# EAGLE design ambe_v2 (EAGLE 6.3)
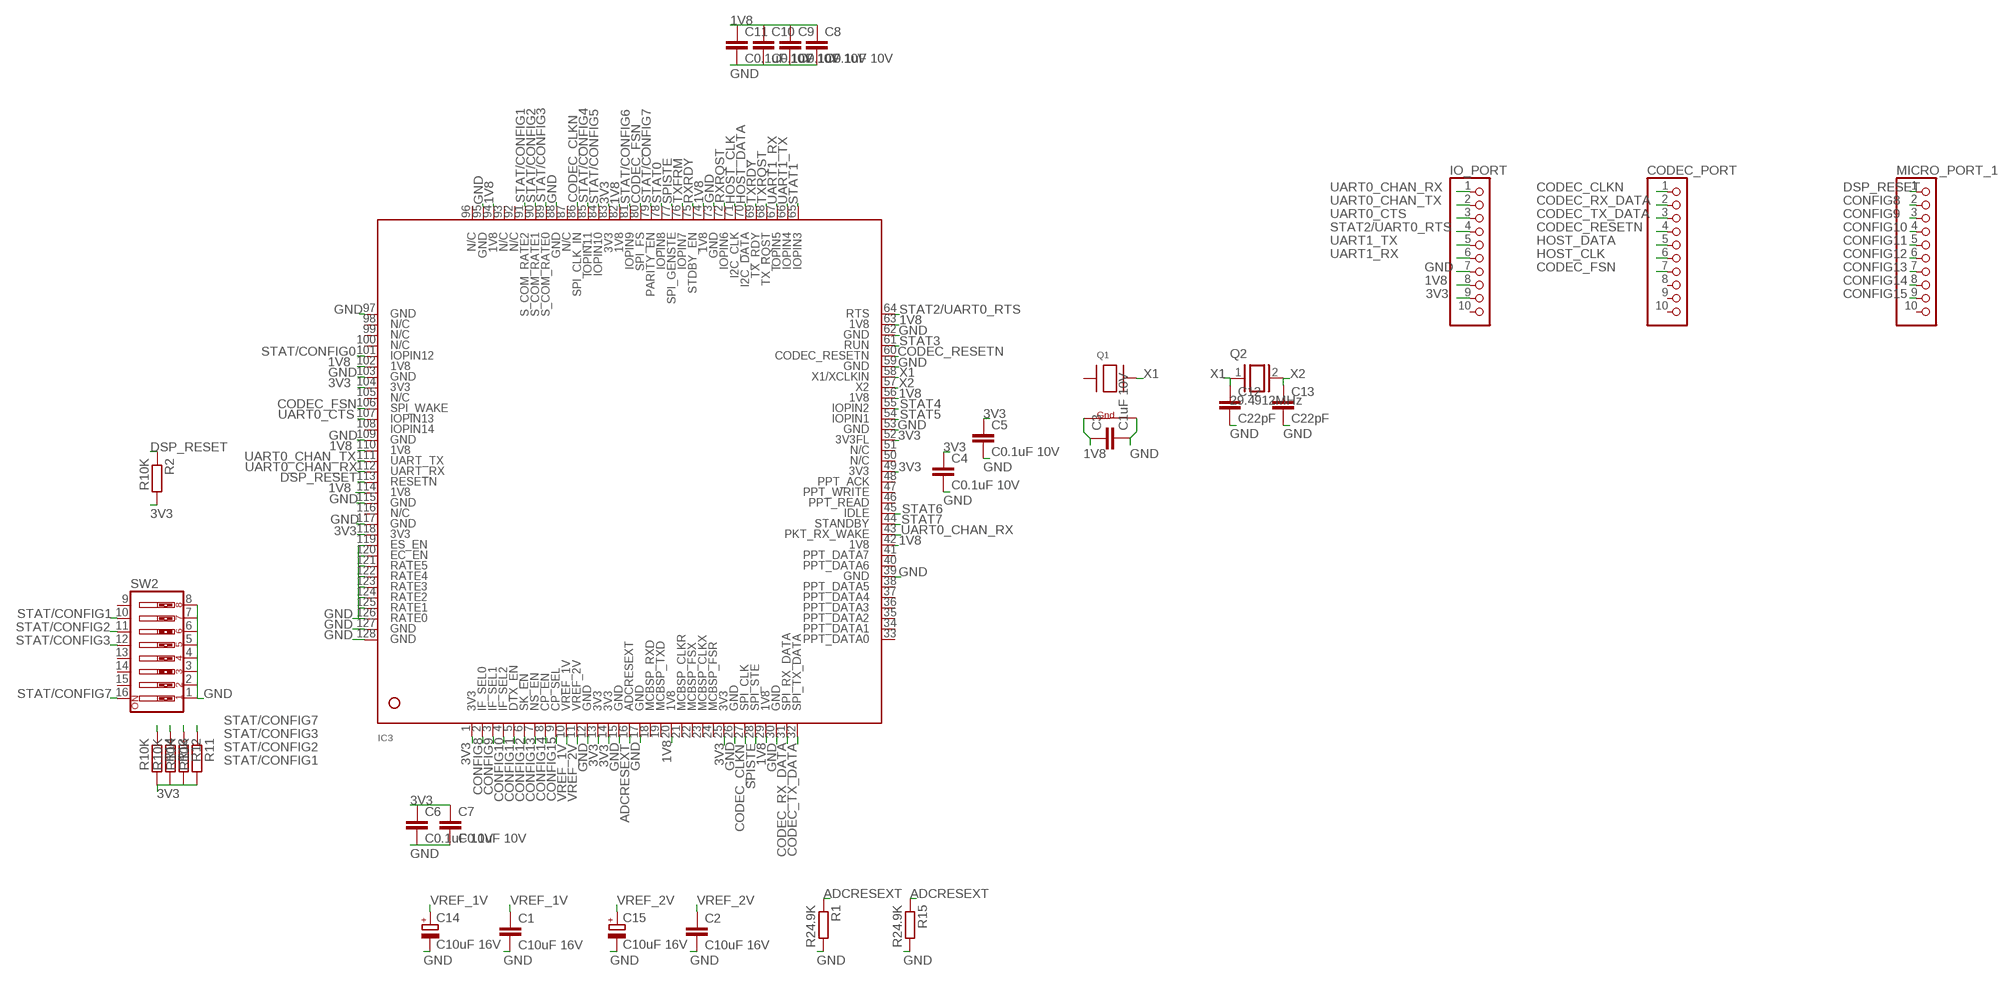
[diagram p0: schematic, sheet 1]

## Parts
C1  C10uF 16V  C-EUC0805  [C0805]
C2  C10uF 16V  C-EUC0805  [C0805]
C3  C1uF 10V  C-EUC0805  [C0805]
C4  C0.1uF 10V  C-EUC0805  [C0805]
C5  C0.1uF 10V  C-EUC0805  [C0805]
C6  C0.1uF 10V  C-EUC0805  [C0805]
C7  C0.1uF 10V  C-EUC0805  [C0805]
C8  C0.1uF 10V  C-EUC0805  [C0805]
C9  C0.1uF 10V  C-EUC0805  [C0805]
C10  C0.1uF 10V  C-EUC0805  [C0805]
C11  C0.1uF 10V  C-EUC0805  [C0805]
C12  C22pF  C-EU025-024X044  [C025-024X044]
C13  C22pF  C-EU025-024X044  [C025-024X044]
C14  C10uF 16V  CPOL-EUE2-4  [E2-4]
C15  C10uF 16V  CPOL-EUE2-4  [E2-4]
CODEC_PORT  PINHD-1X10  [1X10]
IC3  AMBE-3000LQFP-128  [LQFP-128]
IO_PORT  PINHD-1X10  [1X10]
MICRO_PORT_1  PINHD-1X10  [1X10]
Q1  XTAL-4-3225  [NX3225]
Q2  29.4912MHz  XTAL/S  [QS]
R1  R24.9K  R-EU_R0805  [R0805]
R2  R10K  R-EU_R0805  [R0805]
R11  R10K  R-EU_R0805  [R0805]
R12  R10K  R-EU_R0805  [R0805]
R13  R10K  R-EU_R0805  [R0805]
R14  R10K  R-EU_R0805  [R0805]
R15  R24.9K  R-EU_0207/2V  [0207/2V]
SW2  SW_DIP-8  [DIPSWITCH-08]

## Nets
1V8: C3.1 C8.1 C9.1 C10.1 C11.1 IC3.20(1V8) IC3.29(1V8) IC3.42(1V8) IC3.56(1V8) IC3.63(1V8) IC3.74(1V8) IC3.82(1V8) IC3.94(1V8) IC3.102(1V8) IC3.110(1V8) IC3.114(1V8) IO_PORT.8 Q1.4(G1)
3V3: C4.1 C5.1 C6.1 C7.1 IC3.1(3V3) IC3.13(3V3) IC3.14(3V3) IC3.25(3V3) IC3.49(3V3) IC3.52(3V3FL) IC3.83(3V3) IC3.104(3V3) IC3.118(3V3) IO_PORT.9 R2.2 R11.2 R12.2 R13.2 R14.2
ADCRESEXT: IC3.16(ADCRESEXT) R1.1 R15.1
CODEC_CLKN: CODEC_PORT.1 IC3.27(SPI_CLK) IC3.86(SPI_CLK_IN)
CODEC_FSN: CODEC_PORT.7 IC3.80(SPI_FS) IC3.106(SPI_WAKE)
CODEC_RESETN: CODEC_PORT.4 IC3.60(CODEC_RESETN)
CODEC_RX_DATA: CODEC_PORT.2 IC3.31(SPI_RX_DATA)
CODEC_TX_DATA: CODEC_PORT.3 IC3.32(SPI_TX_DATA)
CONFIG8: IC3.2(IF_SEL0) MICRO_PORT_1.2
CONFIG9: IC3.3(IF_SEL1) MICRO_PORT_1.3
CONFIG10: IC3.4(IF_SEL2) MICRO_PORT_1.4
CONFIG11: IC3.5(DTX_EN) MICRO_PORT_1.5
CONFIG12: IC3.6(SK_EN) MICRO_PORT_1.6
CONFIG13: IC3.7(NS_EN) MICRO_PORT_1.7
CONFIG14: IC3.8(CP_EN) MICRO_PORT_1.8
CONFIG15: IC3.9(CP_SEL) MICRO_PORT_1.9
DSP_RESET: IC3.113(RESETN) MICRO_PORT_1.1 R2.1
GND: C1.2 C2.2 C3.2 C4.2 C5.2 C6.2 C7.2 C8.2 C9.2 C10.2 C11.2 C12.2 C13.2 C14.- C15.- IC3.12(GND) IC3.15(GND) IC3.17(GND) IC3.26(GND) IC3.30(GND) IC3.39(GND) IC3.53(GND) IC3.59(GND) IC3.62(GND) IC3.73(GND) IC3.88(GND) IC3.95(GND) IC3.97(GND) IC3.103(GND) IC3.109(GND) IC3.115(GND) IC3.117(GND) IC3.119(ES_EN) IC3.120(EC_EN) IC3.121(RATE5) IC3.122(RATE4) IC3.123(RATE3) IC3.124(RATE2) IC3.125(RATE1) IC3.126(RATE0) IC3.127(GND) IC3.128(GND) IO_PORT.7 Q1.2(G2) R1.2 R15.2 SW2.1 SW2.2 SW2.3 SW2.4 SW2.5 SW2.6 SW2.7 SW2.8
HOST_CLK: CODEC_PORT.6 IC3.71(I2C_CLK)
HOST_DATA: CODEC_PORT.5 IC3.70(I2C_DATA)
RXRDY: IC3.75(STDBY_EN)
RXRQST: IC3.72(IOPIN6)
SPISTE: IC3.28(SPI_STE) IC3.77(SPI_GENSTE)
STAT0: IC3.78(IOPIN8)
STAT1: IC3.65(IOPIN3)
STAT2/UART0_RTS: IC3.64(RTS) IO_PORT.4
STAT3: IC3.61(RUN)
STAT4: IC3.55(IOPIN2)
STAT5: IC3.54(IOPIN1)
STAT6: IC3.45(IDLE)
STAT7: IC3.44(STANDBY)
STAT/CONFIG0: IC3.101(IOPIN12)
STAT/CONFIG1: IC3.91(S_COM_RATE2) R14.1 SW2.10
STAT/CONFIG2: IC3.90(S_COM_RATE1) R13.1 SW2.11
STAT/CONFIG3: IC3.89(S_COM_RATE0) R12.1 SW2.12
STAT/CONFIG4: IC3.85(IOPIN11)
STAT/CONFIG5: IC3.84(IOPIN10)
STAT/CONFIG6: IC3.81(IOPIN9)
STAT/CONFIG7: IC3.79(PARITY_EN) R11.1 SW2.16
TXFRM: IC3.76(IOPIN7)
TXRDY: IC3.69(TX_RDY)
TXRQST: IC3.68(TX_RQST)
UART0_CHAN_RX: IC3.43(PKT_RX_WAKE) IC3.112(UART_RX) IO_PORT.1
UART0_CHAN_TX: IC3.111(UART_TX) IO_PORT.2
UART0_CTS: IC3.107(IOPIN13) IO_PORT.3
UART1_RX: IC3.67(IOPIN5) IO_PORT.6
UART1_TX: IC3.66(IOPIN4) IO_PORT.5
VREF_1V: C1.1 C14.+ IC3.10(VREF_1V)
VREF_2V: C2.1 C15.+ IC3.11(VREF_2V)
X1: C12.1 IC3.58(X1/XCLKIN) Q1.3(X2) Q2.1
X2: C13.1 IC3.57(X2) Q2.2
Unconnected: CODEC_PORT.8 CODEC_PORT.9 CODEC_PORT.10 IC3.18(MCBSP_RXD) IC3.19(MCBSP_TXD) IC3.21(MCBSP_CLKR) IC3.22(MCBSP_FSX) IC3.23(MCBSP_CLKX) IC3.24(MCBSP_FSR) IC3.33(PPT_DATA0) IC3.34(PPT_DATA1) IC3.35(PPT_DATA2) IC3.36(PPT_DATA3) IC3.37(PPT_DATA4) IC3.38(PPT_DATA5) IC3.40(PPT_DATA6) IC3.41(PPT_DATA7) IC3.46(PPT_READ) IC3.47(PPT_WRITE) IC3.48(PPT_ACK) IC3.50(N/C) IC3.51(N/C) IC3.87(N/C) IC3.92(N/C) IC3.93(N/C) IC3.96(N/C) IC3.98(N/C) IC3.99(N/C) IC3.100(N/C) IC3.105(N/C) IC3.108(IOPIN14) IC3.116(N/C) IO_PORT.10 MICRO_PORT_1.10 Q1.1(X1) SW2.9 SW2.13 SW2.14 SW2.15

## Library data of the parts
C1-C13 = resistor:C-EU: CAPACITOR, European symbol
C14 C15 = resistor:CPOL-EU: POLARIZED CAPACITOR, European symbol
CODEC_PORT IO_PORT MICRO_PORT_1 = pinhead:PINHD-1X10: PIN HEADER
IC3 = AMBE-3000:AMBE-3000
Q1 = adafruit:XTAL-4: Classic 4-pin 3.2 x 2.5mm crystal
Q2 = special:XTAL/S: CRYSTAL
R1 R2 R11-R15 = resistor:R-EU_: RESISTOR, European symbol
SW2 = SparkFun-Electromechanical:SW_DIP-8: DIP Switch 8 Position Spark Fun Electronics SKU : COM-08034

## Board
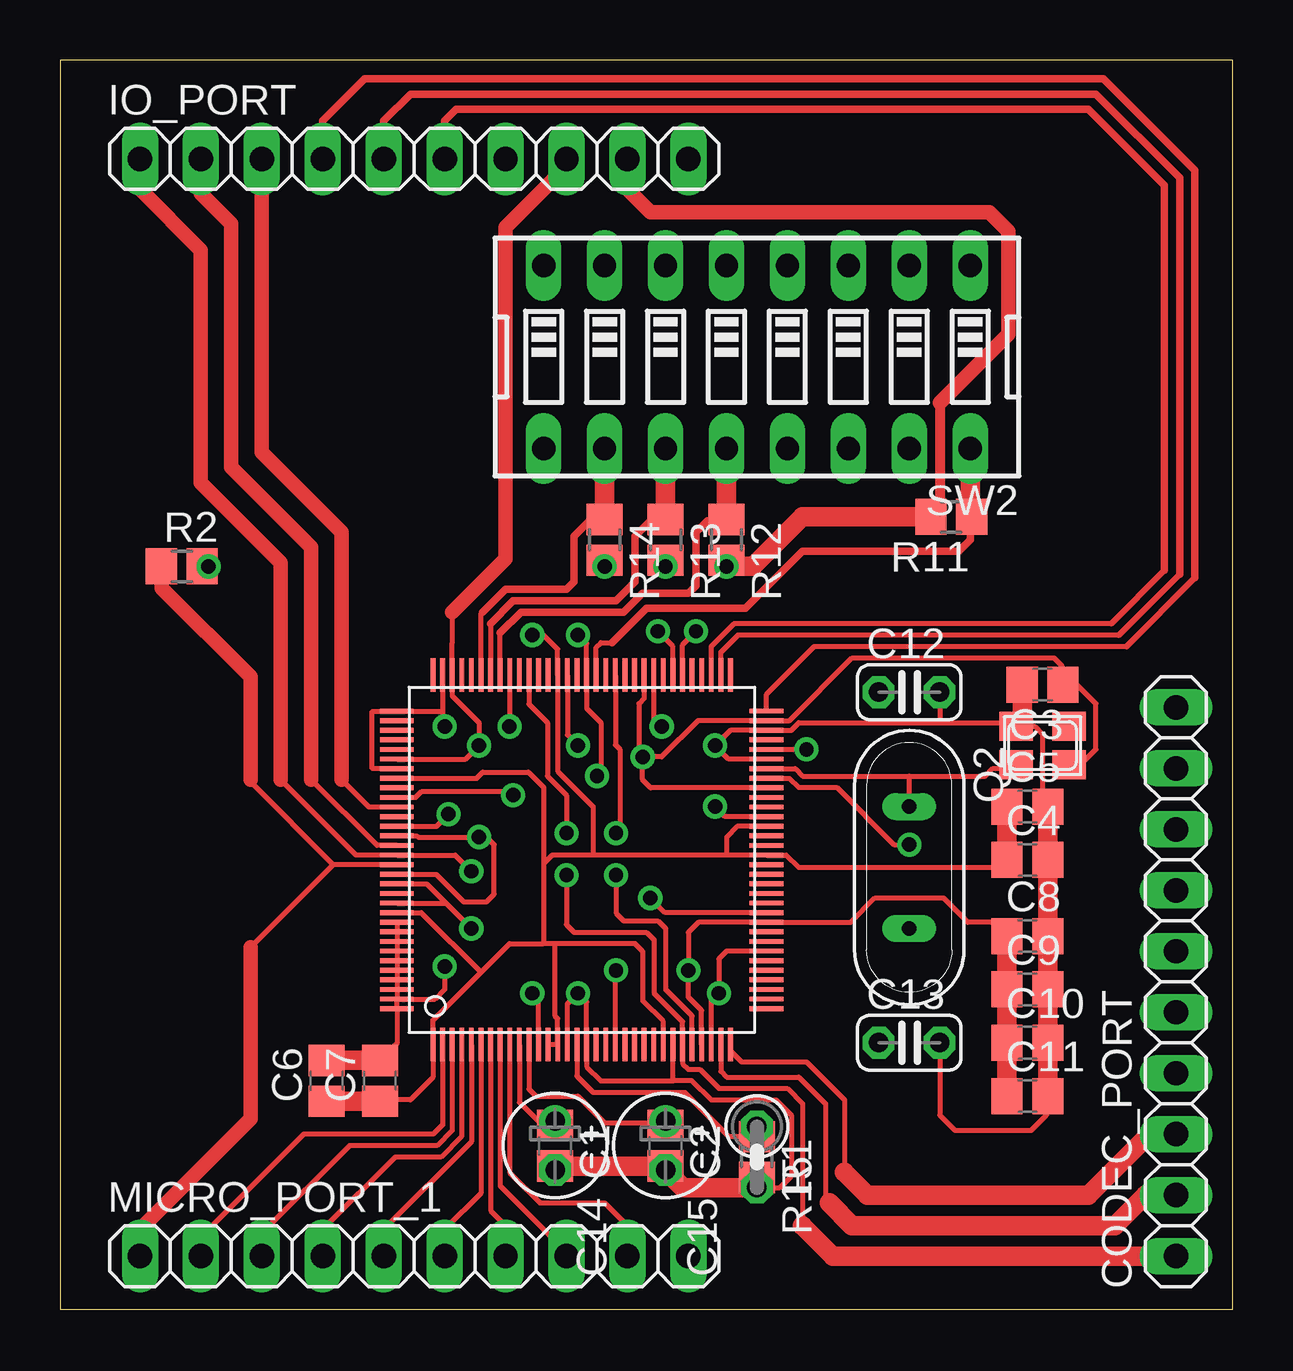
[diagram p1: board, top side]
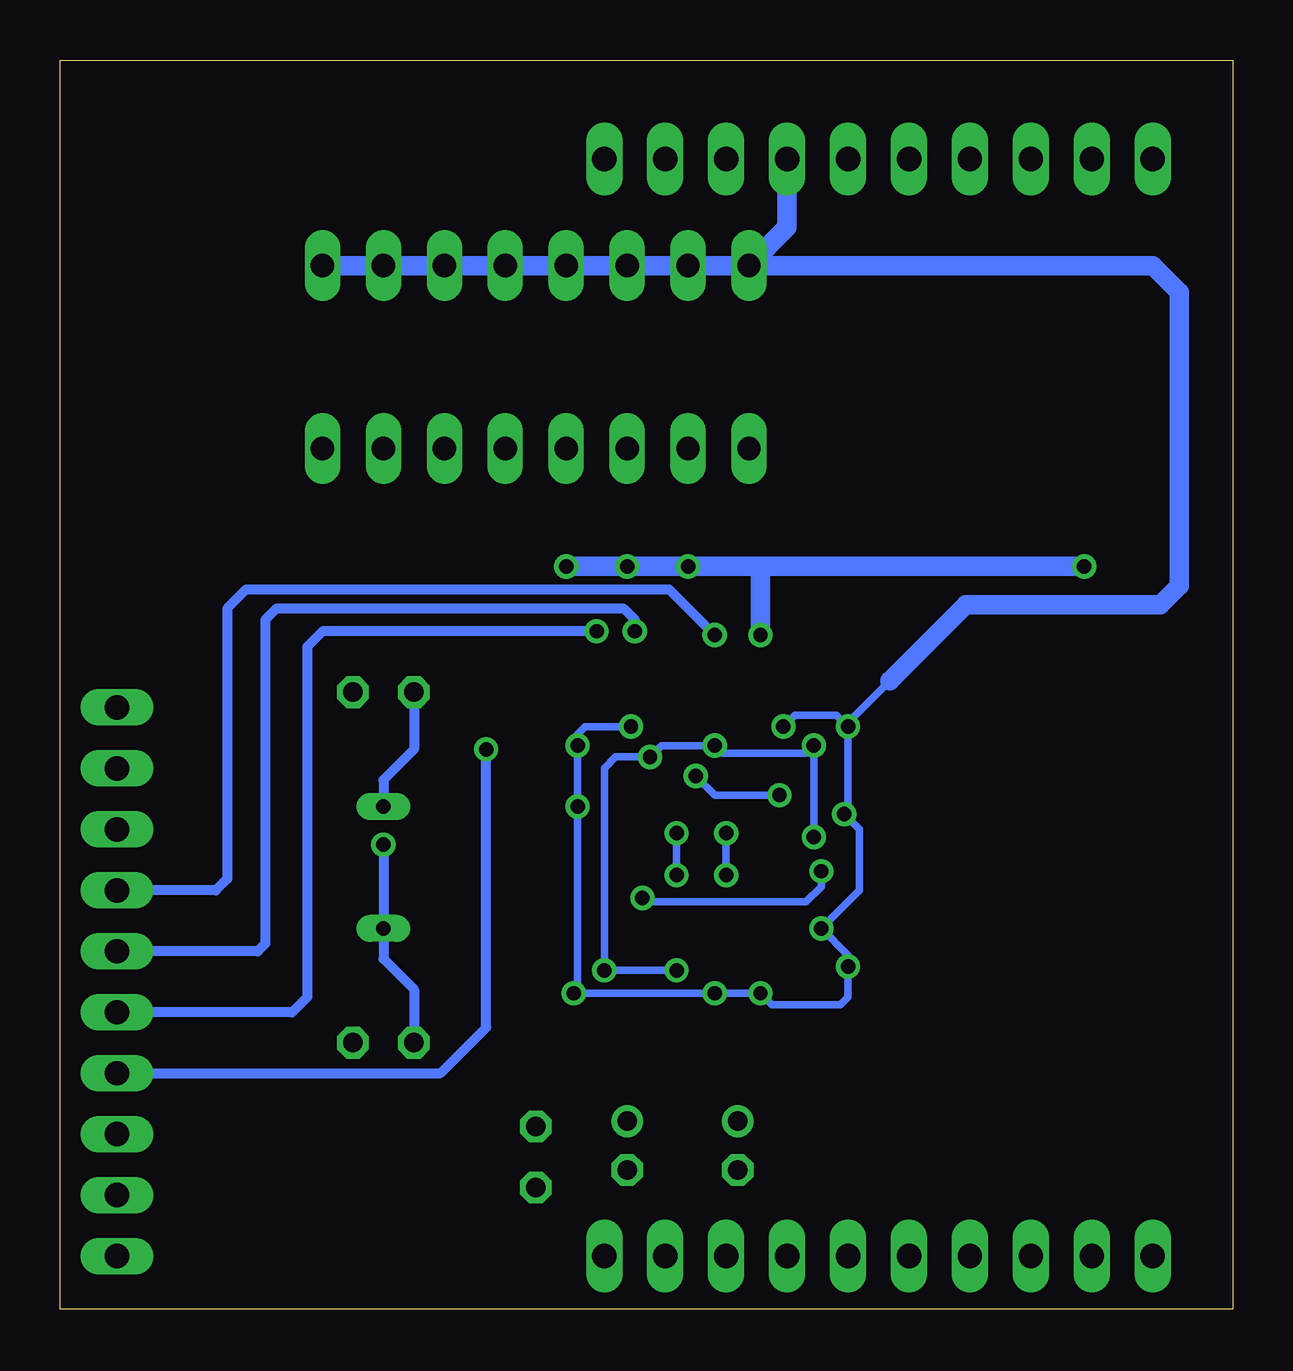
[diagram p2: board, bottom side, seen from below]

Size 48.88 x 52.06 mm. Coordinates in mm from the lower left corner, seen from the top.
Outline: 0,0 48.88,0 48.88,52.06 0,52.06 0,0
Copper layers (1*16): Top 0.035mm / dielectric 1.5mm / Bottom 0.035mm
Design rules "default": minimum track width 10mil, minimum drill 24mil, track to track 11mil, track to pad 11mil, pad to pad 11mil, via to via 11mil, smd to smd 11mil, copper to edge 40mil, drill to drill 8mil, minimum pad ring 10mil, minimum via ring 8mil, stop-mask expansion 4mil, vias tented up to drill 0mil, thermal gap 10mil

### Footprints (pad centres in the part's own frame; a part is rotated, then mirrored left to right if it is on the bottom)
C0805 = smd 1.3 x 1.5: 1 -0.85,0; 2 0.85,0
C025-024X044 = drill 0.813 octagon: 1 -1.27,0; 2 1.27,0
E2-4 = drill 0.813 pad 1.27: + -1.016,0 | drill 0.813 pad 1.27 octagon: - 1.016,0
1X10 = drill 1.016 long: 1 -11.43,0; 2 -8.89,0; 3 -6.35,0; 4 -3.81,0; 5 -1.27,0; 6 1.27,0; 7 3.81,0; 8 6.35,0; 9 8.89,0; 10 11.43,0
LQFP-128 = smd 0.2 x 1.4: 1 -6.2,-7.7; 2 -5.8,-7.7; 3 -5.4,-7.7; 4 -5,-7.7; 5 -4.6,-7.7; 6 -4.2,-7.7; 7 -3.8,-7.7; 8 -3.4,-7.7; 9 -3,-7.7; 10 -2.6,-7.7; 11 -2.2,-7.7; 12 -1.8,-7.7; 13 -1.4,-7.7; 14 -1,-7.7; 15 -0.6,-7.7; 16 -0.2,-7.7; 17 0.2,-7.7; 18 0.6,-7.7; 19 1,-7.7; 20 1.4,-7.7; 21 1.8,-7.7; 22 2.2,-7.7; 23 2.6,-7.7; 24 3,-7.7; 25 3.4,-7.7; 26 3.8,-7.7; 27 4.2,-7.7; 28 4.6,-7.7; 29 5,-7.7; 30 5.4,-7.7; 31 5.8,-7.7; 32 6.2,-7.7; 65 6.2,7.7; 66 5.8,7.7; 67 5.4,7.7; 68 5,7.7; 69 4.6,7.7; 70 4.2,7.7; 71 3.8,7.7; 72 3.4,7.7; 73 3,7.7; 74 2.6,7.7; 75 2.2,7.7; 76 1.8,7.7; 77 1.4,7.7; 78 1,7.7; 79 0.6,7.7; 80 0.2,7.7; 81 -0.2,7.7; 82 -0.6,7.7; 83 -1,7.7; 84 -1.4,7.7; 85 -1.8,7.7; 86 -2.2,7.7; 87 -2.6,7.7; 88 -3,7.7; 89 -3.4,7.7; 90 -3.8,7.7; 91 -4.2,7.7; 92 -4.6,7.7; 93 -5,7.7; 94 -5.4,7.7; 95 -5.8,7.7; 96 -6.2,7.7 | smd 1.4 x 0.2: 33 7.7,-6.2; 34 7.7,-5.8; 35 7.7,-5.4; 36 7.7,-5; 37 7.7,-4.6; 38 7.7,-4.2; 39 7.7,-3.8; 40 7.7,-3.4; 41 7.7,-3; 42 7.7,-2.6; 43 7.7,-2.2; 44 7.7,-1.8; 45 7.7,-1.4; 46 7.7,-1; 47 7.7,-0.6; 48 7.7,-0.2; 49 7.7,0.2; 50 7.7,0.6; 51 7.7,1; 52 7.7,1.4; 53 7.7,1.8; 54 7.7,2.2; 55 7.7,2.6; 56 7.7,3; 57 7.7,3.4; 58 7.7,3.8; 59 7.7,4.2; 60 7.7,4.6; 61 7.7,5; 62 7.7,5.4; 63 7.7,5.8; 64 7.7,6.2; 97 -7.7,6.2; 98 -7.7,5.8; 99 -7.7,5.4; 100 -7.7,5; 101 -7.7,4.6; 102 -7.7,4.2; 103 -7.7,3.8; 104 -7.7,3.4; 105 -7.7,3; 106 -7.7,2.6; 107 -7.7,2.2; 108 -7.7,1.8; 109 -7.7,1.4; 110 -7.7,1; 111 -7.7,0.6; 112 -7.7,0.2; 113 -7.7,-0.2; 114 -7.7,-0.6; 115 -7.7,-1; 116 -7.7,-1.4; 117 -7.7,-1.8; 118 -7.7,-2.2; 119 -7.7,-2.6; 120 -7.7,-3; 121 -7.7,-3.4; 122 -7.7,-3.8; 123 -7.7,-4.2; 124 -7.7,-4.6; 125 -7.7,-5; 126 -7.7,-5.4; 127 -7.7,-5.8; 128 -7.7,-6.2
NX3225 = smd 1.4 x 1.2: 1 -1.1,-0.8; 2 1.1,-0.8; 3 1.1,0.8; 4 -1.1,0.8
QS = drill 0.61 long: 1 -2.54,0; 2 2.54,0
R0805 = smd 1.3 x 1.5: 1 -0.85,0; 2 0.85,0
0207/2V = drill 0.813 octagon: 1 -1.27,0; 2 1.27,0
DIPSWITCH-08 = drill 0.97 long: 1 -8.89,-3.81; 2 -6.35,-3.81; 3 -3.81,-3.81; 4 -1.27,-3.81; 5 1.27,-3.81; 6 3.81,-3.81; 7 6.35,-3.81; 8 8.89,-3.81; 9 8.89,3.81; 10 6.35,3.81; 11 3.81,3.81; 12 1.27,3.81; 13 -1.27,3.81; 14 -3.81,3.81; 15 -6.35,3.81; 16 -8.89,3.81

### Placement (x,y rotation side)
C1  20.64,6.83 270 top
C2  25.24,6.83 270 top
C3  40.96,26.04 180 top
C4  40.32,18.73 0 top
C5  40.32,20.95 0 top
C6  11.11,9.53 90 top
C7  13.34,9.53 90 top
C8  40.32,15.56 0 top
C9  40.32,13.34 0 top
C10  40.32,11.11 0 top
C11  40.32,8.89 0 top
C12  35.4,25.72 0 top
C13  35.4,11.11 0 top
C14  20.64,6.83 270 top
C15  25.24,6.83 270 top
CODEC_PORT  46.51,13.65 90 top
IC3  21.75,18.73 0 top
IO_PORT  14.76,47.94 0 top
MICRO_PORT_1  14.76,2.22 0 top
Q1  40.96,23.5 180 top
Q2  35.4,18.41 270 top
R1  29.05,6.35 270 top
R2  5.08,30.96 0 top
R11  37.15,33.02 180 top
R12  27.78,32.07 270 top
R13  25.24,32.07 270 top
R14  22.7,32.07 270 top
R15  29.05,6.35 270 top
SW2  29.05,39.69 180 top

### Tracks (layer width: path | path; a pad name or v marks a point on that pad's centre or on a via)
1V8  (via drill 0.6)
  Top 0.203: IC3.82 21.15,23.94 v21.59,23.5 | IC3.56 24.62,21.73 24.29,22.07 v24.29,23.02 | IC3.74 24.35,25.46 24.13,25.24 24.13,23.18 v24.29,23.02 | IC3.114 15.68,18.13 16.83,16.99 17.78,16.99 18.1,17.3 18.1,19.37 17.78,19.68 v17.46,19.68 14.92,19.68 14.88,19.73 IC3.110 | IC3.102 16.9,22.93 v17.46,23.5 17.46,24.45 16.35,25.56 IC3.94 16.35,27.78 16.35,27.79 16.35,29.05 | Q1.4 42.54,22.7 43.18,23.34 43.18,25.24 42.39,26.04 C3.1 41.75,26.09 41.75,26.83 41.43,27.15 33.02,27.15 30.41,24.53 IC3.63 26.6,24.53 25.08,23.02 v24.29,23.02 | IC3.20 23.15,14.1 v23.18,14.13 | IC3.29 26.75,12.46 26.19,13.02 v26.19,14.13 26.19,15.72 26.61,16.13 IC3.42 32.96,16.13 33.97,17.14 36.83,17.14 37.84,16.13 38.9,16.13
  Top 0.305: 38.9,16.13 C8.1
  Top 0.61: IO_PORT.8 21.11,47.62 18.57,45.09 18.57,31.27 16.35,29.05
  Top 0.813: C8.1 C9.1 C10.1 C11.1
  Bottom 0.305: v23.18,14.13 v26.19,14.13 26.19,22.54 25.72,23.02 v24.29,23.02 23.81,23.5 v21.59,23.5 21.27,23.18 17.78,23.18 v17.46,23.5 v17.46,19.68
3V3  (via drill 0.6)
  Top 0.203: IC3.13 IC3.14 20.75,12.11 20.64,12.22 20.64,15.24 | 13.39,8.73 14.61,8.73 15.55,9.68 IC3.1 15.55,12.06 17.54,14.05 | IC3.104 17.37,22.13 17.62,22.38 19.53,22.38 20.16,21.75 20.16,18.57 | IC3.49 28.1,18.93 | IC3.49 27.78,18.93 | 27.78,18.93 22.23,18.93 | IC3.25 25.15,12 24.29,12.86 24.29,14.92 23.97,15.24 20.64,15.24 | IC3.52 28.23,20.13 27.78,19.68 27.78,18.93 | IC3.118 15.06,16.53 17.54,14.05 | 22.23,18.93 22.23,20.95 20.75,22.43 IC3.83 20.75,27.51 20.16,28.1 v19.68,28.1 | 22.23,18.93 20.52,18.93 20.16,18.57 | 20.16,18.57 20.16,15.24 | 17.54,14.05 18.73,15.24 20.16,15.24 | 20.64,15.24 20.16,15.24 | IC3.49 30.28,18.93 30.8,18.41 39.16,18.41 C4.1
  Top 0.305: 13.39,8.73 C7.1 | 39.27,18.93 C4.1 | 27.73,31.17 R12.2
  Top 0.406: 36.67,37.78 36.67,33.39
  Top 0.61: IO_PORT.9 23.65,46.67 24.61,45.72 38.73,45.72 39.53,44.93 39.53,40.64 36.67,37.78 | 36.67,33.39 R11.2 | v22.7,30.96 R14.2 | v25.24,30.96 R13.2 | v27.78,30.96 R12.2
  Top 0.813: C7.1 C6.1 | C5.1 C4.1 | R11.2 30.96,33.02 28.89,30.96 v27.78,30.96 | R2.2 v6.19,30.96
  Bottom 0.813: v27.78,30.96 v25.24,30.96 v22.7,30.96 19.68,30.96 | v6.19,30.96 19.68,30.96 | v19.68,28.1 19.68,30.96
ADCRESEXT
  Top 0.203: IC3.16 21.55,9.72 22.23,9.05 26.04,9.05 27.88,7.2 R1.1 R15.1
CODEC_CLKN  (via drill 0.6)
  Top 0.203: IC3.86 19.55,25.22 20.32,24.45 20.32,22.23 21.11,21.43 v21.11,19.84 | v21.11,18.1 21.11,16.03 21.43,15.72 24.45,15.72 24.77,15.4 24.77,13.18 25.95,11.99 IC3.27 25.95,10.25 26.19,10 26.67,10 27.46,9.21 30.32,9.21 30.96,8.57 30.96,3.49
  Top 0.813: 30.96,3.49 32.23,2.22 CODEC_PORT.1
  Bottom 0.305: v21.11,19.84 v21.11,18.1
CODEC_FSN  (via drill 0.6)
  Top 0.203: IC3.106 14.82,21.33 15.08,21.59 18.73,21.59 v18.89,21.43 | v21.59,28.1 21.95,27.74 IC3.80 21.95,25.04 22.54,24.45 22.54,22.38 v22.38,22.23
  Bottom 0.305: v22.38,22.23 21.59,21.43 v18.89,21.43
  Bottom 0.406: v21.59,28.1 23.5,30 41.12,30 41.91,29.21 41.91,17.94 42.39,17.46 CODEC_PORT.7
CODEC_RESETN  (via drill 0.6)
  Top 0.203: IC3.60 v31.11,23.33 v31.11,23.34
  Bottom 0.406: CODEC_PORT.4 33.02,9.84 31.11,11.75 v31.11,23.34
CODEC_RX_DATA
  Top 0.203: IC3.31 27.55,9.92 27.78,9.68 30.8,9.68 31.91,8.57 31.91,4.6 32.07,4.45
  Top 0.813: CODEC_PORT.2 45.24,4.76 43.97,3.49 33.02,3.49 32.07,4.45
CODEC_TX_DATA
  Top 0.203: IC3.32 27.95,10.79 28.42,10.32 31.11,10.32 32.7,8.73 32.7,5.71
  Top 0.813: CODEC_PORT.3 45.4,7.3 42.86,4.76 33.66,4.76 32.7,5.71
CONFIG8
  Top 0.203: IC3.2 15.95,7.69 15.56,7.3 10.16,7.3 5.87,3.02 MICRO_PORT_1.2
CONFIG9
  Top 0.203: IC3.3 16.35,7.46 15.72,6.83 12.06,6.83 8.41,3.17 MICRO_PORT_1.3
CONFIG10
  Top 0.203: IC3.4 16.75,7.22 15.88,6.35 13.97,6.35 10.95,3.33 MICRO_PORT_1.4
CONFIG11
  Top 0.203: IC3.5 17.15,6.99 13.49,3.33 MICRO_PORT_1.5
CONFIG12
  Top 0.203: IC3.6 17.55,4.85 16.03,3.33 MICRO_PORT_1.6
CONFIG13
  Top 0.203: IC3.7 17.95,4.12 18.57,3.49 MICRO_PORT_1.7
CONFIG14
  Top 0.203: IC3.8 18.35,5.15 21.11,2.38 MICRO_PORT_1.8
CONFIG15
  Top 0.203: IC3.9 18.75,5.7 20,4.45 22.7,4.45 23.65,3.49 MICRO_PORT_1.9
DSP_RESET
  Top 0.203: IC3.113 11.39,18.53 | 11.39,18.53 7.94,15.08 | 7.94,22.07 7.94,21.98 11.39,18.53
  Top 0.61: R2.1 4.23,30.06 7.94,26.35 7.94,22.07 | MICRO_PORT_1.1 3.33,3.33 7.94,7.94 7.94,15.08
GND  (via drill 0.6)
  Top 0.203: IC3.127 IC3.128 14.05,11.09 C7.2 | IC3.103 13.02,22.53 13.02,24.92 IC3.97 15.94,24.93 15.95,24.92 | IC3.117 16.09,16.93 | IC3.73 24.75,24.62 v25.08,24.29 | IC3.15 21.15,12.73 v21.59,13.18 21.95,12.82 IC3.17 21.95,10.12 22.54,9.53 25.56,9.53 | IC3.12 19.95,12.91 v19.68,13.18 | IC3.30 27.15,12.86 v27.46,13.18 27.46,14.61 27.79,14.93 IC3.39 | IC3.59 27.87,22.93 v27.3,23.5 27.94,24.13 IC3.62 30.48,24.13 30.8,24.45 36.67,24.45 | IC3.53 27.73,20.53 v27.3,20.95 | IC3.95 15.95,24.92 | 15.95,24.92 15.95,24.37 v16.03,24.29 | IC3.127 15.63,12.93 16.03,13.34 v16.03,14.29 | 16.09,16.93 v17.14,15.88 | IC3.115 15.29,17.73 16.09,16.93 | Q1.2 | Q1.2 40.63,24.3 40.96,23.97 40.96,21.17 C5.2 | IC3.88 18.75,24.3 v18.73,24.29 | IC3.109 15.69,20.13 v16.19,20.64 | 25.56,9.53 25.55,9.54 IC3.26 | 25.56,9.53 26.35,9.53 27.15,8.73 29.84,8.73 30.48,8.1 30.48,5.56 30,5.08 R15.2 R1.2 | 36.67,24.45 39.7,24.45 Q1.2 | C12.2 36.67,24.45 | C13.2 36.67,8.1 37.31,7.46 40.48,7.46 41.12,8.1 41.12,8.83 C11.2 | IC3.119 IC3.120 IC3.121 IC3.122 IC3.123 IC3.124 IC3.125 IC3.126 IC3.127 | C2.2 C15.- | C1.2 C14.-
  Top 0.813: C6.2 C7.2 | C11.2 C10.2 C9.2 C8.2 C4.2 C5.2 | C3.2 40.11,24.55 Q1.2 | C1.2 C2.2 | R15.2 25.97,5.08 C15.-
  Bottom 0.305: v25.08,24.29 26.99,24.29 27.3,23.97 v27.3,23.5 v27.3,20.95 27.3,13.34 v27.46,13.18 v21.59,13.18 v19.68,13.18 19.21,12.7 16.35,12.7 16.03,13.02 v16.03,14.29 16.03,14.76 v17.14,15.88 15.56,17.46 15.56,20 v16.19,20.64 16.03,20.8 v16.03,24.29 | v16.03,24.29 16.51,24.77 18.26,24.77 v18.73,24.29 | v16.03,24.29 16.03,24.45 14.29,26.19
  Bottom 0.813: SW2.1 SW2.2 SW2.3 SW2.4 SW2.5 SW2.6 SW2.7 SW2.8 | IO_PORT.7 18.57,45.09 SW2.8 | SW2.8 3.33,43.5 2.22,42.39 2.22,30.16 3.02,29.37 11.11,29.37 14.29,26.19
HOST_CLK  (via drill 0.6)
  Top 0.203: IC3.71 25.55,27.63 v24.92,28.26
  Bottom 0.406: CODEC_PORT.6 40.64,14.92 40.32,15.24 40.32,28.73 39.85,29.21 25.4,29.21 24.92,28.73 v24.92,28.26
HOST_DATA  (via drill 0.6)
  Top 0.203: IC3.70 25.95,27.7 v26.51,28.26
  Bottom 0.406: CODEC_PORT.5 39.21,12.38 38.58,13.02 38.58,27.62 37.94,28.26 v26.51,28.26
SPISTE  (via drill 0.6)
  Top 0.203: IC3.28 26.35,12.23 25.24,13.34 25.24,15.88 24.92,16.19 23.5,16.19 23.18,16.51 v23.18,18.1 | IC3.77 23.15,23.52 23.34,23.34 23.34,20 v23.18,19.84
  Bottom 0.305: v23.18,19.84 v23.18,18.1
STAT2/UART0_RTS
  Top 0.203: IC3.64 29.45,25.64 31.43,27.62 44.45,27.62
  Top 0.254: 44.45,27.62 47.31,30.48
  Top 0.305: 47.31,30.48 47.31,47.47 43.5,51.28 12.7,51.28 10.95,49.53 IO_PORT.4
STAT/CONFIG1
  Top 0.203: IC3.91 17.55,28.98 17.62,29.05
  Top 0.305: R14.1 22.64,32.86 22.07,32.86 21.43,32.23 21.43,30.32 21.11,30 18.57,30 17.62,29.05
  Top 0.813: SW2.10 R14.1
STAT/CONFIG2
  Top 0.203: 17.94,28.57 17.94,26.44 IC3.90
  Top 0.305: R13.1 25.18,32.86 24.61,32.86 23.97,32.23 23.97,30.32 23.18,29.53 18.89,29.53 17.94,28.57
  Top 0.813: SW2.11 R13.1
STAT/CONFIG3
  Top 0.203: IC3.89 18.35,28.19
  Top 0.305: R12.1 27.73,32.86 26.99,32.86 26.51,32.38 26.51,30.16 26.19,29.84 24.29,29.84 23.5,29.05 19.21,29.05 18.35,28.19
  Top 0.813: SW2.12 R12.1
STAT/CONFIG7
  Top 0.203: IC3.79 22.35,27.59 22.54,27.78 23.02,27.78
  Top 0.305: R11.1 37.94,32.96 37.94,32.07 37.47,31.59 30.96,31.59 28.57,29.21 24.45,29.21 23.02,27.78
  Top 0.813: SW2.16 37.94,33.08 R11.1
UART0_CHAN_RX  (via drill 0.6)
  Top 0.203: v17.14,18.26 16.47,18.93 IC3.112 12.34,18.93 9.21,22.07 | IC3.43 25.22,16.53 v24.61,17.14
  Top 0.61: IO_PORT.1 3.33,46.67 5.87,44.13 5.87,34.45 9.21,31.11 9.21,22.07
  Bottom 0.305: v17.14,18.26 17.14,17.62 17.78,16.99 24.45,16.99 v24.61,17.14
UART0_CHAN_TX
  Top 0.203: IC3.111 13.21,19.33 10.48,22.07
  Top 0.61: IO_PORT.2 5.87,46.51 7.14,45.24 7.14,35.08 10.48,31.75 10.48,22.07
UART0_CTS
  Top 0.203: IC3.107 12.88,20.93 11.75,22.07
  Top 0.61: IO_PORT.3 8.41,35.72 11.75,32.38 11.75,22.07
UART1_RX
  Top 0.203: IC3.67 27.15,27.62 28.1,28.57 43.81,28.57
  Top 0.254: 43.81,28.57 46.04,30.8
  Top 0.305: 46.04,30.8 46.04,46.83 42.86,50.01 16.51,50.01 16.03,49.53 IO_PORT.6
UART1_TX
  Top 0.203: IC3.66 27.55,27.39 28.26,28.1 44.13,28.1
  Top 0.254: 44.13,28.1 46.67,30.64
  Top 0.305: 46.67,30.64 46.67,47.15 43.18,50.64 14.61,50.64 13.49,49.53 IO_PORT.5
VREF_1V
  Top 0.203: IC3.10 19.15,8.63 20,7.78 20.57,7.78 | 20.57,7.78 C14.+ | 20.57,7.78 20.57,7.74 C1.1
  Top 0.305: 20.58,8.1 C1.1
VREF_2V
  Top 0.203: IC3.11 19.55,9.19 19.84,8.89 21.59,8.89 22.7,7.78 25.14,7.78 C2.1 C15.+
X1
  Top 0.203: IC3.58 30.65,22.53 30.96,22.23 35.4,22.23 | 39.55,22.38 Q1.3 39.7,22.54 38.89,22.54 38.58,22.23 35.4,22.23 | Q2.1 35.4,22.23
  Bottom 0.406: C12.1 34.13,23.34 35.4,22.07 Q2.1
X2  (via drill 0.6)
  Top 0.203: IC3.57 30.41,22.13 30.8,21.75 32.38,21.75 34.77,19.37 v35.4,19.37
  Bottom 0.406: C13.1 34.13,13.34 35.4,14.61 Q2.2 v35.4,19.37